# EAGLE design Spectroscilloscope Revised_2 (EAGLE 9.6.2)
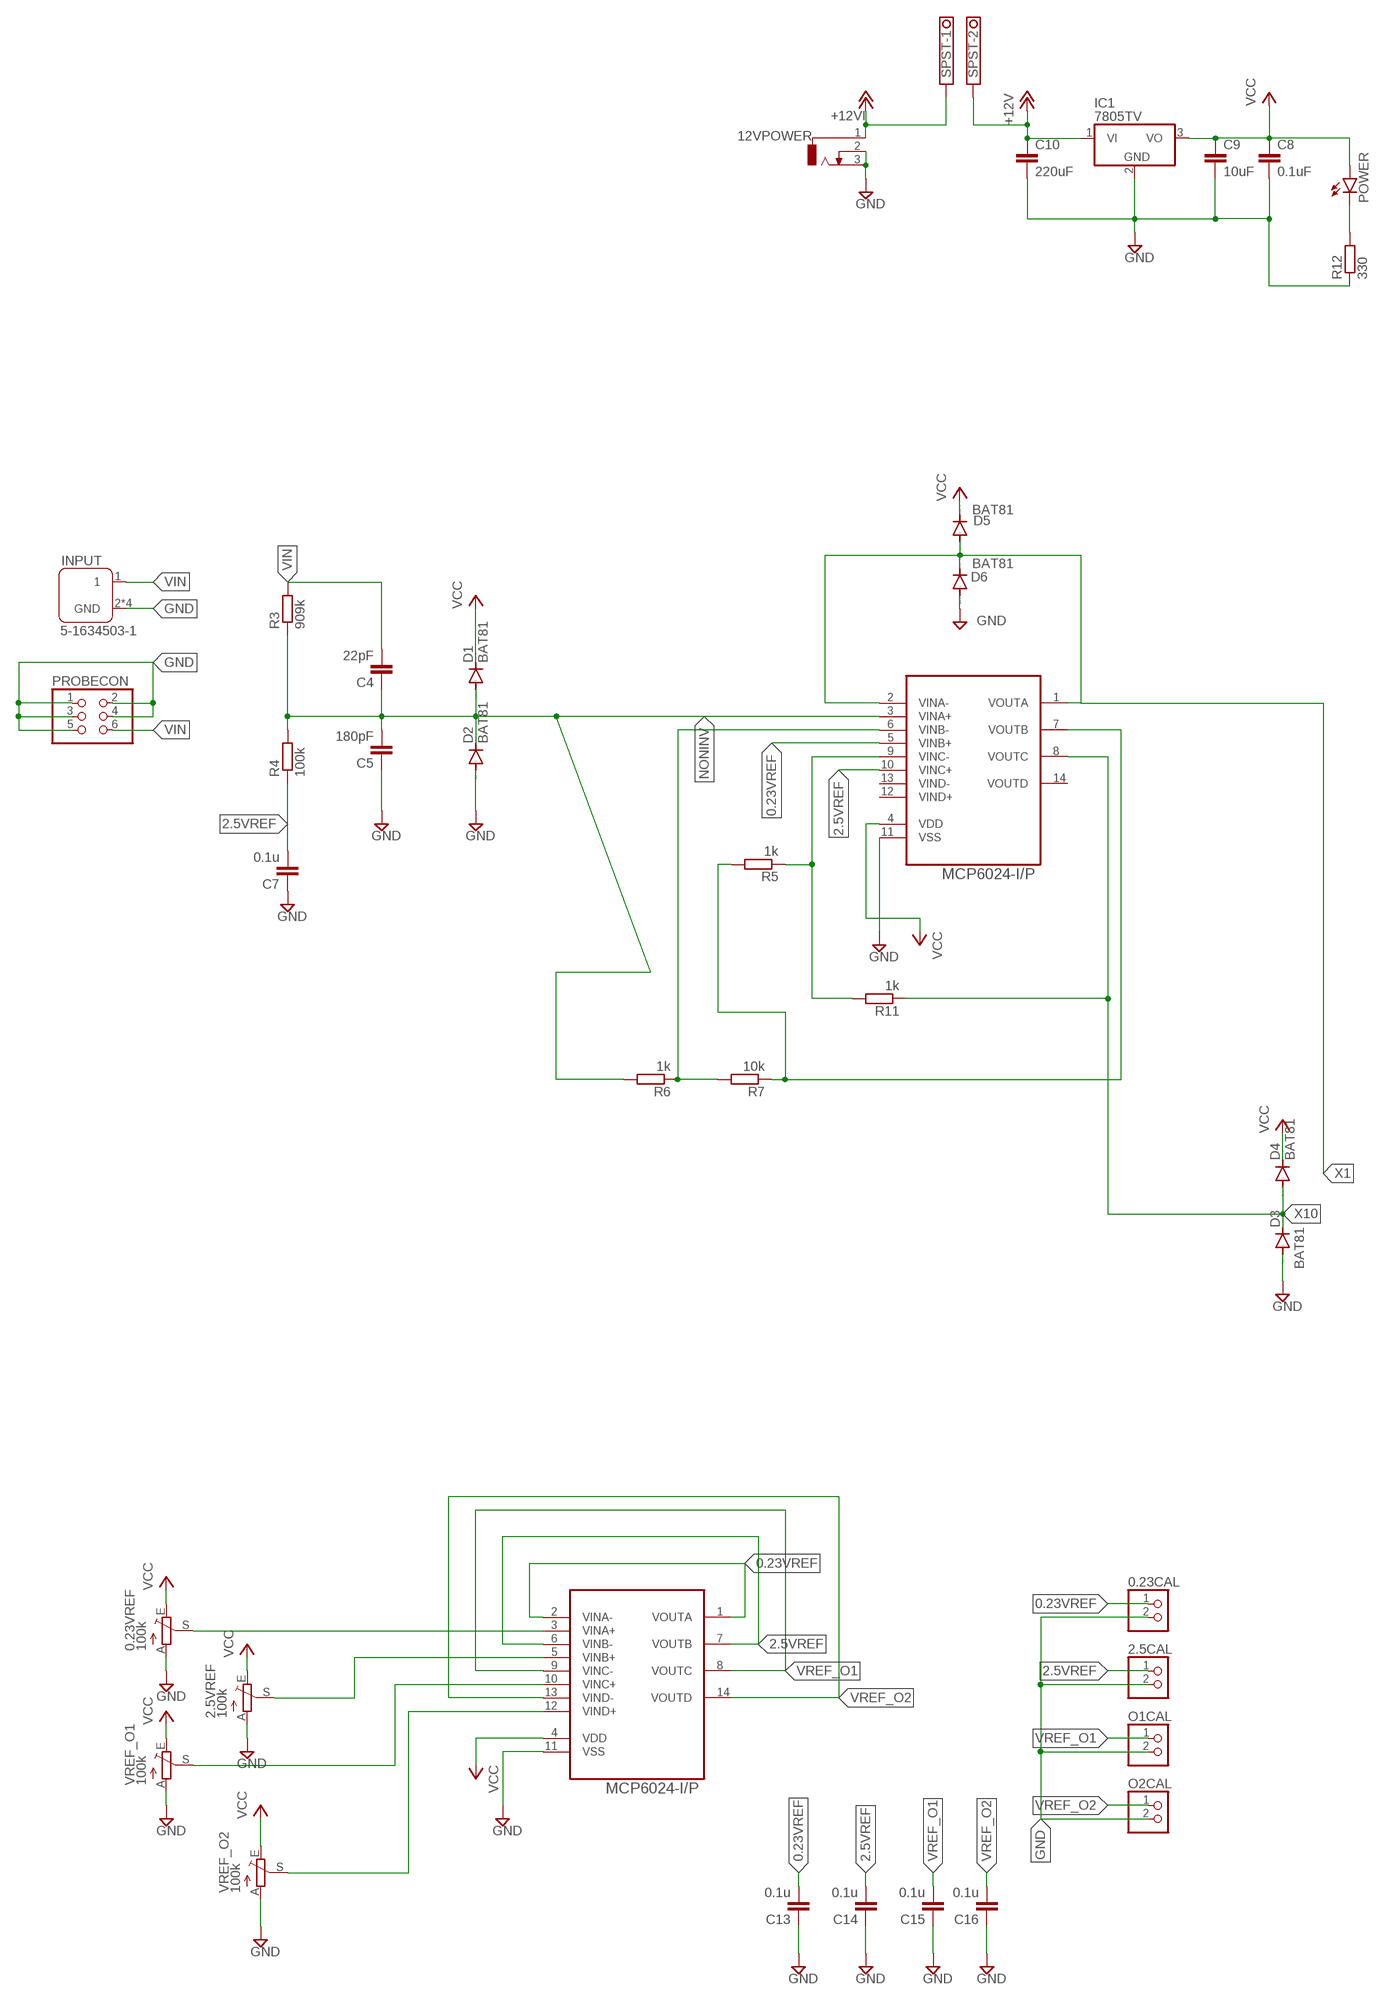
[diagram p0: schematic, sheet 1, part 1 of 2]
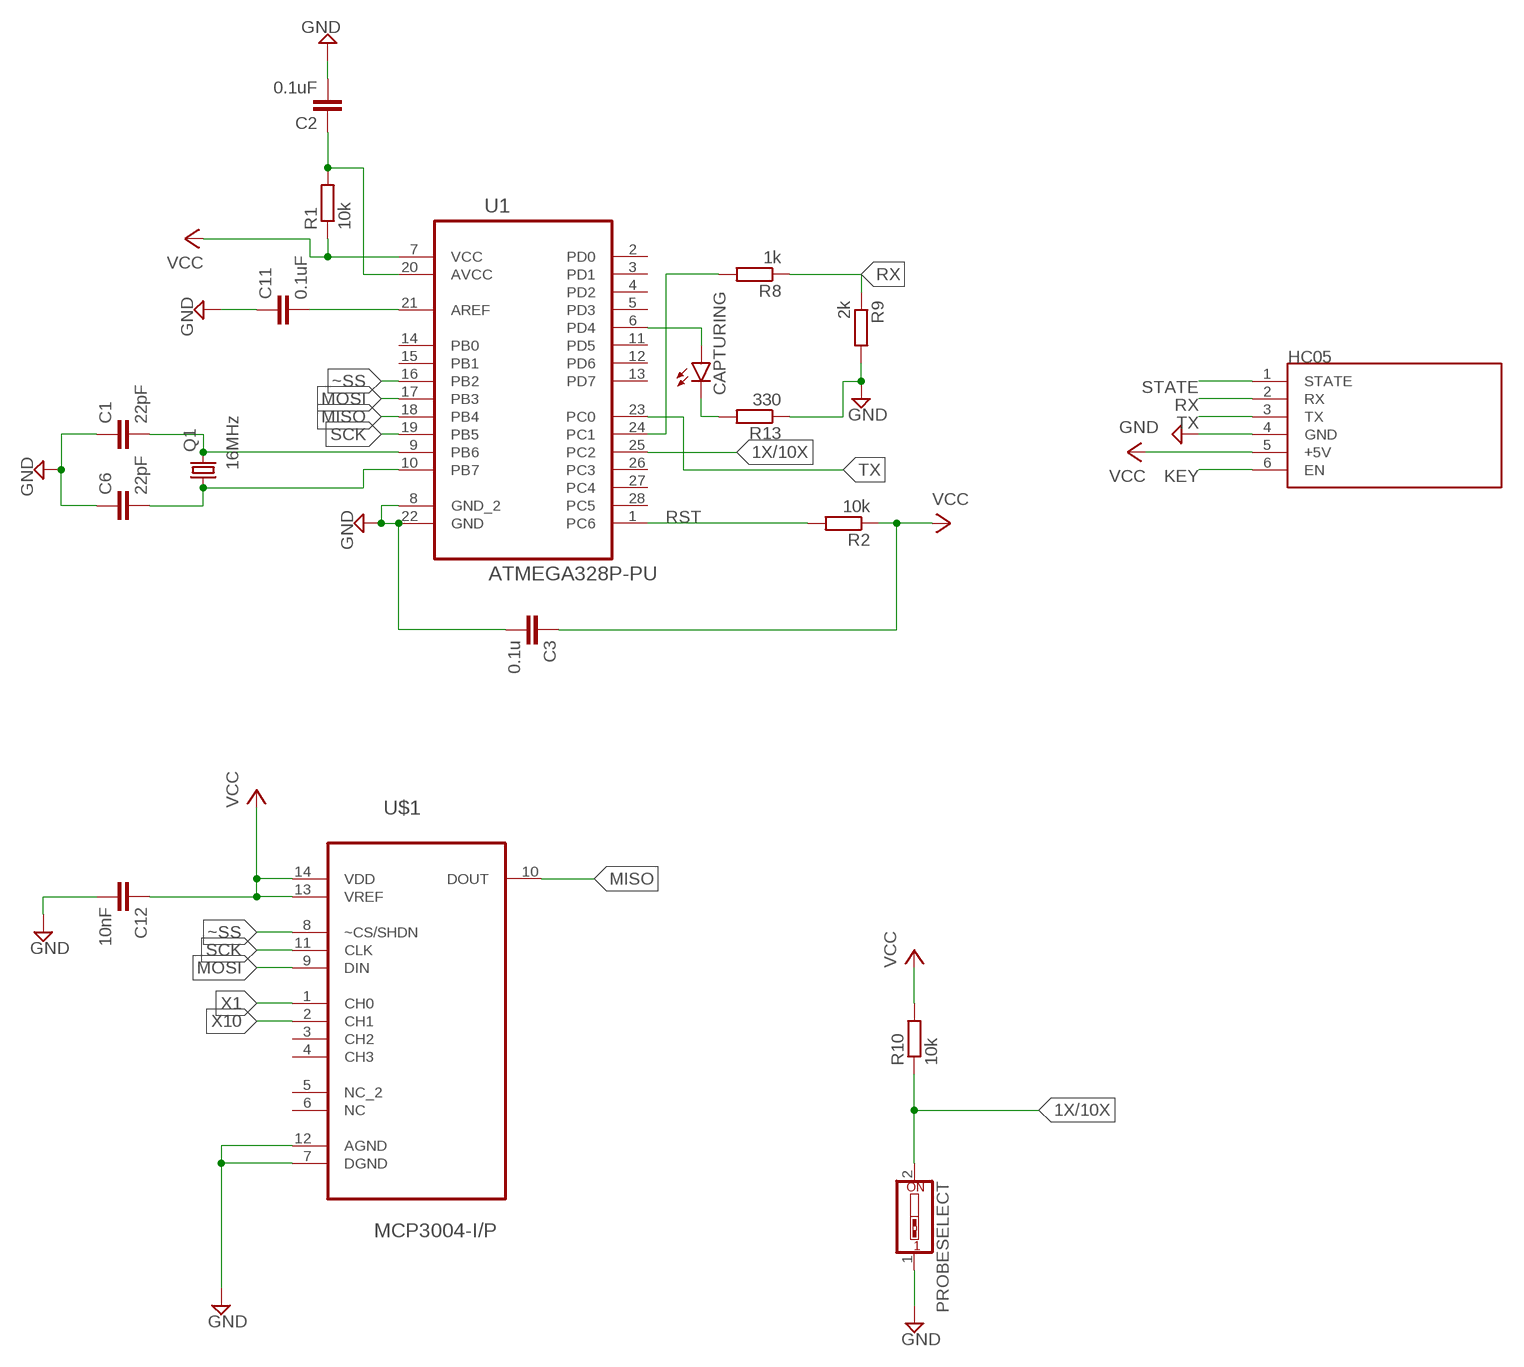
[diagram p1: schematic, sheet 1, part 2 of 2]

## Parts
0.23CAL  PINHD-1X2  [1X02]
0.23VREF  100k  TRIM_EU-B25P  [B25P]
2.5CAL  PINHD-1X2  [1X02]
2.5VREF  100k  TRIM_EU-B25P  [B25P]
12VPOWER  DCJ0303  [DCJ0303]
C1  22pF  C-EU050-024X044  [C050-024X044]
C2  0.1uF  C-EU050-024X044  [C050-024X044]
C3  0.1u  C-EU050-024X044  [C050-024X044]
C4  22pF  C-EU050-024X044  [C050-024X044]
C5  180pF  C-EU050-024X044  [C050-024X044]
C6  22pF  C-EU050-024X044  [C050-024X044]
C7  0.1u  C-EU050-024X044  [C050-024X044]
C8  0.1uF  C-EU050-024X044  [C050-024X044]
C9  10uF  C-EU050-024X044  [C050-024X044]
C10  220uF  C-EU050-024X044  [C050-024X044]
C11  0.1uF  C-EU050-024X044  [C050-024X044]
C12  10nF  C-EU050-024X044  [C050-024X044]
C13  0.1u  C-EU050-024X044  [C050-024X044]
C14  0.1u  C-EU050-024X044  [C050-024X044]
C15  0.1u  C-EU050-024X044  [C050-024X044]
C16  0.1u  C-EU050-024X044  [C050-024X044]
CAPTURING  LED5MM  [LED5MM]
D1  BAT81  [DO34-7]
D2  BAT81  [DO34-7]
D3  BAT81  [DO34-7]
D4  BAT81  [DO34-7]
D5  BAT81  [DO34-7]
D6  BAT81  [DO34-7]
HC05  WIRELESS-BLUETOOTH-HC-05  [WIRELESS-BLUETOOTH-HC-05]
IC1  7805TV  [TO220V]
INPUT  5-1634503-1  [TE_5-1634503-1]
O1CAL  PINHD-1X2  [1X02]
O2CAL  PINHD-1X2  [1X02]
POWER  LED5MM  [LED5MM]
PROBECON  PINHD-2X3  [2X03]
PROBESELECT  SW_DIP-1  [EDG-01]
Q1  16MHz  CRYSTALHC49U-V  [HC49U-V]
R1  10k  R-EU_0204/7  [0204/7]
R2  10k  R-EU_0204/7  [0204/7]
R3  909k  R-EU_0204/7  [0204/7]
R4  100k  R-EU_0204/7  [0204/7]
R5  1k  R-EU_0204/7  [0204/7]
R6  1k  R-EU_0204/7  [0204/7]
R7  10k  R-EU_0204/7  [0204/7]
R8  1k  R-EU_0204/7  [0204/7]
R9  2k  R-EU_0204/7  [0204/7]
R10  10k  R-EU_0204/7  [0204/7]
R11  1k  R-EU_0204/7  [0204/7]
R12  330  R-EU_0204/7  [0204/7]
R13  330  R-EU_0204/7  [0204/7]
SPST  TERMINAL-BLOCK-3.5MM-2-PIN-LONG-PAD  [TERMINAL-BLOCK-2-PIN-3.5MM-LONG-PAD]
U1  ATMEGA328P-PU  [DIP254P762X457-28]
U2  MCP6024-I/P  [DIP254P762X533-14]
U3  MCP6024-I/P  [DIP254P762X533-14]
U$1  MCP3004-I/P  [DIP254P762X432-14]
VREF_O1  100k  TRIM_EU-B25P  [B25P]
VREF_O2  100k  TRIM_EU-B25P  [B25P]

## Nets
0.23VREF: 0.23CAL.1 C13.2 U2.5(VINB+) U3.1(VOUTA) U3.2(VINA-)
1X/10X: PROBESELECT.2 R10.1 U1.25(PC2)
2.5VREF: 2.5CAL.1 C7.2 C14.2 R4.1 U2.10(VINC+) U3.6(VINB-) U3.7(VOUTB)
+12V [Power Lines]: C10.1 IC1.1(VI) SPST.2
+12VI [Power Lines]: 12VPOWER.1 SPST.1 ; supply symbol labelled +12V
GND [Power Lines]: 0.23CAL.2 0.23VREF.A 2.5CAL.2 2.5VREF.A 12VPOWER.2 12VPOWER.3 C1.1 C2.2 C3.2 C5.1 C6.1 C7.1 C8.2 C9.2 C10.2 C11.1 C12.2 C13.1 C14.1 C15.1 C16.1 D2.A D3.A D6.A HC05.4(GND) IC1.2(GND) INPUT.2(GND) INPUT.3(GND) INPUT.4(GND) INPUT.5(GND) O1CAL.2 O2CAL.2 PROBECON.1 PROBECON.2 PROBECON.3 PROBECON.4 PROBECON.5 PROBESELECT.1 R9.2 R12.1 R13.1 U1.8(GND_2) U1.22(GND) U2.11(VSS) U3.11(VSS) U$1.7(DGND) U$1.12(AGND) VREF_O1.A VREF_O2.A
KEY: HC05.6(EN)
MISO: U1.18(PB4) U$1.10(DOUT)
MOSI: U1.17(PB3) U$1.9(DIN)
N$1: C1.2 Q1.2 U1.9(PB6)
N$2: C6.2 Q1.1 U1.10(PB7)
N$3: 2.5VREF.S U3.5(VINB+)
N$4: R5.2 R7.1 U2.7(VOUTB)
N$5: R6.1 R7.2 U2.6(VINB-)
N$6: C11.2 U1.21(AREF)
N$7: U3.10(VINC+) VREF_O1.S
N$8: C2.1 R1.2 U1.20(AVCC)
N$9: 0.23VREF.S U3.3(VINA+)
N$10: U3.12(VIND+) VREF_O2.S
N$11: R3.1 R4.2
N$12: POWER.K(C) R12.2
N$13: CAPTURING.K(C) R13.2
N$14: CAPTURING.A U1.6(PD4)
N$16: R5.1 R11.2 U2.9(VINC-)
N$17: R8.2 U1.24(PC1)
NONINV: C4.1 C5.2 D1.A D2.C R6.2 U2.3(VINA+)
RST: R2.2 U1.1(PC6)
RX: HC05.2(RX) R8.1 R9.1
SCK: U1.19(PB5) U$1.11(CLK)
STATE: HC05.1(STATE)
TX: HC05.3(TX) U1.23(PC0)
VCC [Power Lines]: 0.23VREF.E 2.5VREF.E C3.1 C8.1 C9.1 C12.1 D1.C D4.C D5.C HC05.5(+5V) IC1.3(VO) POWER.A R1.1 R2.1 R10.2 U1.7(VCC) U2.4(VDD) U3.4(VDD) U$1.13(VREF) U$1.14(VDD) VREF_O1.E VREF_O2.E
VIN: C4.2 INPUT.1 PROBECON.6 R3.2
VREF_O1: C15.2 O1CAL.1 U3.8(VOUTC) U3.9(VINC-)
VREF_O2: C16.2 O2CAL.1 U3.13(VIND-) U3.14(VOUTD)
X1: D5.A D6.C U2.1(VOUTA) U2.2(VINA-) U$1.1(CH0)
X10: D3.C D4.A R11.1 U2.8(VOUTC) U$1.2(CH1)
~SS: U1.16(PB2) U$1.8(~CS/SHDN)
Unconnected: U1.2(PD0) U1.3(PD1) U1.4(PD2) U1.5(PD3) U1.11(PD5) U1.12(PD6) U1.13(PD7) U1.14(PB0) U1.15(PB1) U1.26(PC3) U1.27(PC4) U1.28(PC5) U2.12(VIND+) U2.13(VIND-) U2.14(VOUTD) U$1.3(CH2) U$1.4(CH3) U$1.5(NC_2) U$1.6(NC)

## Library data of the parts
0.23CAL 2.5CAL O1CAL O2CAL = pinhead:PINHD-1X2: PIN HEADER
0.23VREF 2.5VREF VREF_O1 VREF_O2 = pot:TRIM_EU-: POTENTIOMETER
12VPOWER = con-jack:DCJ0303: DC POWER JACK Source: DCJ0303.pdf
C1-C16 = rcl:C-EU: CAPACITOR, European symbol; SPICEPREFIX: C
CAPTURING POWER = led:LED: LED OSRAM: - CHIPLED LG R971, LG N971, LY N971, LG Q971, LY Q971, LO R971, LY R971 LH N974, LH R974 LS Q976, LO Q976, LY Q976 LO Q996 - Hyper CHIPLED LW Q18S LB Q993, LB Q99A, LB R99A - SideLED LS A670, LO A670, LY A670, LG A670, LP A670 LB A673, LV A673, LT A673, LW A673 LH A674 LY A675 LS A676, LA A676, LO A676, LY A676, LW A676 LS A679, LY A679, LG A679 - Hyper Micro SIDELED® LS Y876, LA Y876, LO Y876, LY Y876 LT Y87S - SmartLED LW L88C, LW L88S LB L89C, LB L89S, LG L890 LS L89K, LO L89K, LY L89K LS L896, LA L896, LO L896, LY L896 - TOPLED LS T670, LO T670, LY T670, LG T670, LP T670 LSG T670, LSP T670, LSY T670, LOP T670, LYG T670 LG T671, LOG T671, LSG T671 LB T673, LV T673, LT T673, LW T673 LH T674 LS T676, LA T676, LO T676, LY T676, LB T676, LH T676, LSB T676, LW T676 LB T67C, LV T67C, LT T67C, LS T67K, LO T67K, LY T67K, LW E67C LS E67B, LA E67B, LO E67B, LY E67B, LB E67C, LV E67C, LT E67C LW T67C LS T679, LY T679, LG T679 LS T770, LO T770, LY T770, LG T770, LP T770 LB T773, LV T773, LT T773, LW T773 LH T774 LS E675, LA E675, LY E675, LS T675 LS T776, LA T776, LO T776, LY T776, LB T776 LHGB T686 LT T68C, LB T68C - Hyper Mini TOPLED® LB M676 - Mini TOPLED Santana® LG M470 LS M47K, LO M47K, LY M47K Source: http://www.osram.convergy.de LUXEON: - LUMILED® LXK2-PW12-R00, LXK2-PW12-S00, LXK2-PW14-U00, LXK2-PW14-V00 LXK2-PM12-R00, LXK2-PM12-S00, LXK2-PM14-U00 LXK2-PE12-Q00, LXK2-PE12-R00, LXK2-PE12-S00, LXK2-PE14-T00, LXK2-PE14-U00 LXK2-PB12-K00, LXK2-PB12-L00, LXK2-PB12-M00, LXK2-PB14-N00, LXK2-PB14-P00, LXK2-PB14-Q00 LXK2-PR12-L00, LXK2-PR12-M00, LXK2-PR14-Q00, LXK2-PR14-R00 LXK2-PD12-Q00, LXK2-PD12-R00, LXK2-PD12-S00 LXK2-PH12-R00, LXK2-PH12-S00 LXK2-PL12-P00, LXK2-PL12-Q00, LXK2-PL12-R00 Source: www.luxeon.com KINGBRIGHT: KA-3528ASYC Source: www.kingbright.com
D1-D6 = diode:BAT81: DIODE barrier diode
HC05 = diy-modules:WIRELESS-BLUETOOTH-HC-05: Bluetooth Transceiver Module based on HC-05 board Tutorial is available here: https://arduino-info.wikispaces.com/BlueTooth-HC05-HC06-Modules-How-To Click here to find device on ebay.com <http://www.ebay.com/sch/hc-05+module+rs232>
IC1 = linear:78*: Positive VOLTAGE REGULATOR Source: http://cache.national.com/ds/LM/LM78L05.pdf http://www.fairchildsemi.com/ds/LM/LM7805.pdf
INPUT = 5-1634503-1:5-1634503-1: CONN BNC JACK STR 50 OHM PCB Check prices <https://pricing.snapeda.com/parts/5-1634503-1/TE%20Connectivity/view-part?ref=eda>; AVAILABILITY: Good; COMMENT: 5-1634503-1; DESCRIPTION: Rf / Coaxial Connector, Bnc Coaxial, Straight Jack, Solder, 50 Ohm, Brass; EU_ROHS_COMPLIANCE: Compliant; MF: TE Connectivity; MP: 5-1634503-1; NUMBER_OF_POSITIONS: 1; PACKAGE: None; PRICE: None; PURCHASE-URL: https://pricing.snapeda.com/search/part/5-1634503-1/?ref=eda
PROBECON = pinhead:PINHD-2X3: PIN HEADER
PROBESELECT = special:SW_DIP-1: DIP SWITCH
Q1 = crystal:CRYSTAL: CRYSTAL; OC_FARNELL: 1666969; OC_NEWARK: unknown
R1-R13 = rcl:R-EU_: RESISTOR, European symbol; SPICEPREFIX: R
SPST = Rembrandt Electronics - Terminal Block 3-5mm v1-0:TERMINAL-BLOCK-3.5MM-2-PIN: Terminal Block 3.5mm Pitch: 3,5 mm Number of pins: 2 Created by Rembrandt Electronics www.rembrandtelectronics.com
U1 = ATMEGA328P-PU:ATMEGA328P-PU: 8-bit Microcontroller with In-System Programmable Flash Buy Part <https://snapeda.com/parts/ATMEGA328P-PU/Microchip/view-part/?ref=eda>; AVAILABILITY: Good; DESCRIPTION: AVR AVR® ATmega Microcontroller IC 8-Bit 20MHz 32KB (16K x 16) FLASH 28-PDIP; DIGIKEY-PURCHASE-URL: https://snapeda.com/shop?store=DigiKey&id=2895131; MF: Microchip; MOUSER-PURCHASE-URL: https://snapeda.com/shop?store=Mouser&id=2895131; MP: ATMEGA328P-PU; PACKAGE: DIP-28 Generic; PRICE: None
U2 U3 = MCP6024-I_P:MCP6024-I/P: IC OPAMP 2.5V QUAD R-R Check prices <https://pricing.snapeda.com/parts/MCP6024-I/P/Microchip%20Technology/view-part?ref=eda>; AVAILABILITY: Warning; DESCRIPTION: IC OPAMP GP 4 CIRCUIT 14DIP; MF: Microchip Technology; MP: MCP6024-I/P; PACKAGE: None; PRICE: None; PURCHASE-URL: https://pricing.snapeda.com/search/part/MCP6024-I/P/?ref=eda
U$1 = MCP3004-I_P:MCP3004-I/P: A/D Converters; AVAILABILITY: Unavailable; DESCRIPTION: 10 Bit Analog to Digital Converter 2, 4 Input 1 SAR 14-PDIP; MF: Microchip; MP: MCP3004-I/P; PACKAGE: DIP-14 Microchip; PRICE: None

## Net classes
0 default: width 0.406 mm, clearance 0.102 mm
1 Power Lines: width 0.762 mm, clearance 0.13 mm

## Board
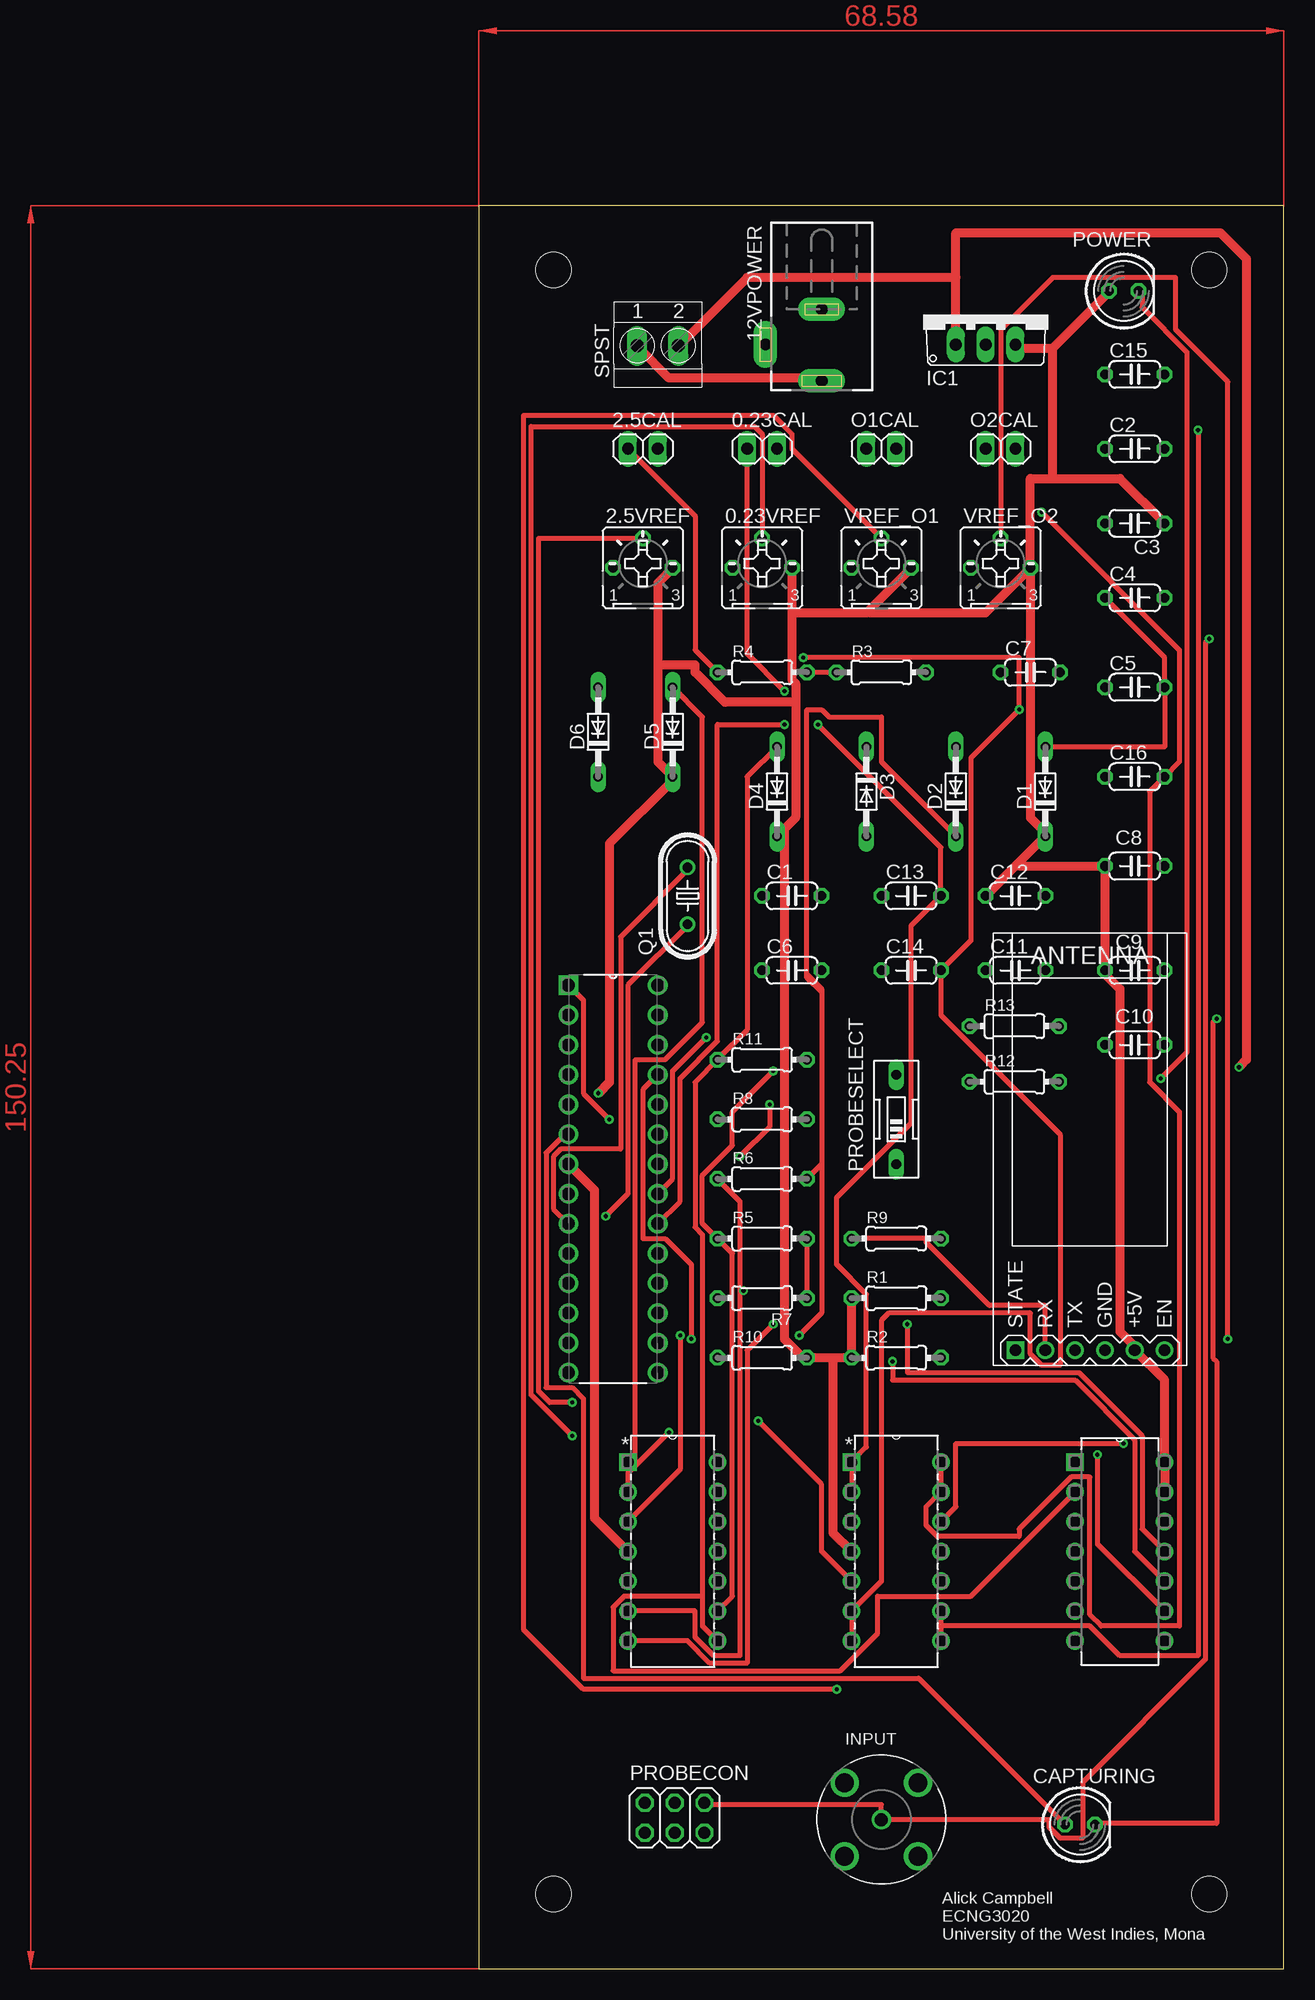
[diagram p2: board, top side]
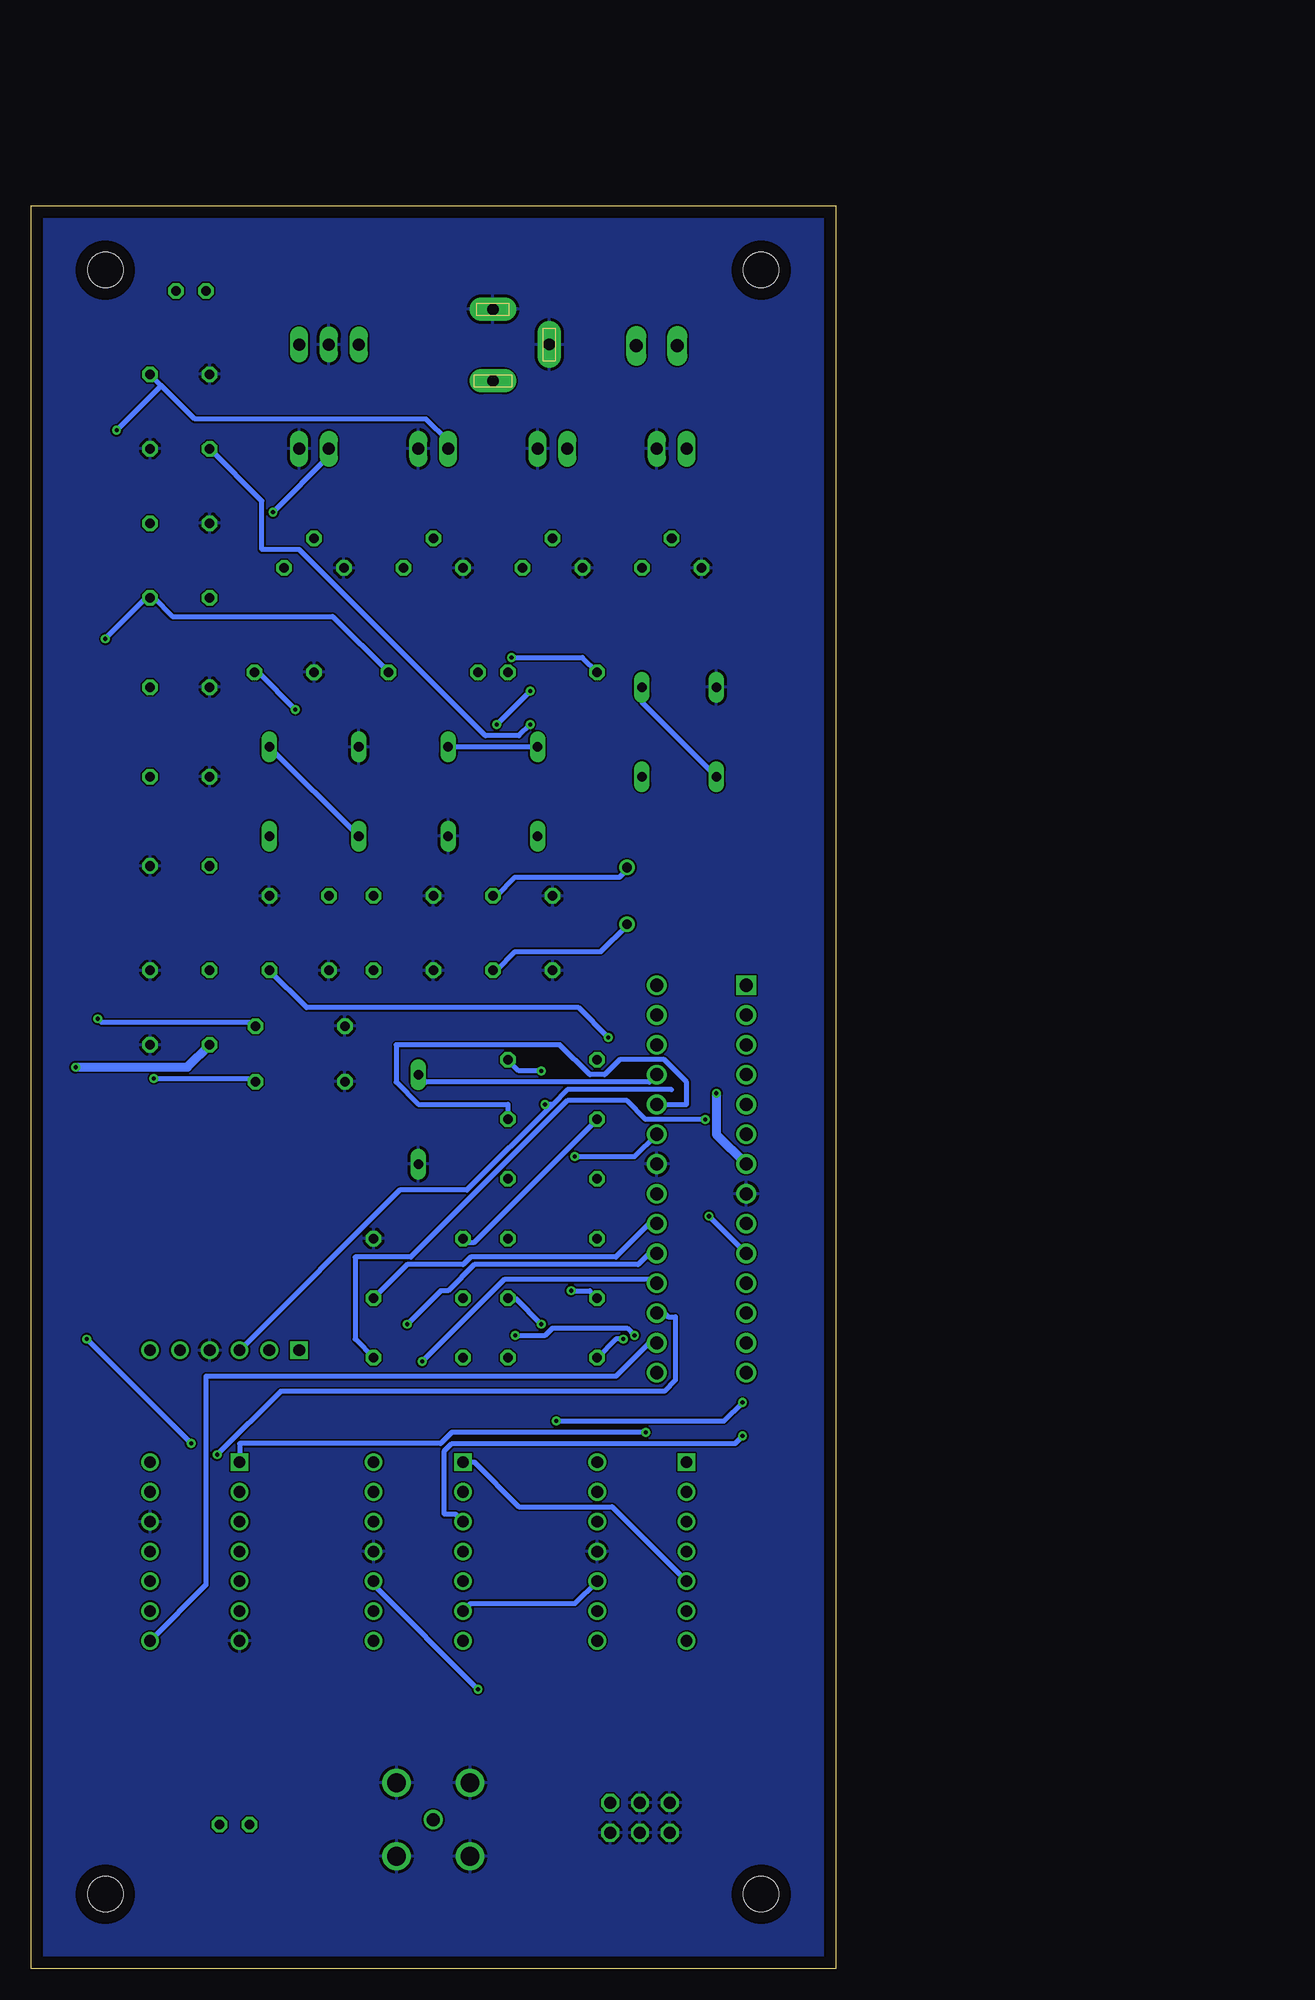
[diagram p3: board, bottom side, seen from below]

Size 68.56 x 150.25 mm. Coordinates in mm from the lower left corner, seen from the top.
Outline: 0,0 68.56,0 68.56,150.25 0,150.25 0,0
Copper layers (1*16): Top 0.035mm / dielectric 1.5mm / Bottom 0.035mm
Design rules "default": minimum track width 6mil, minimum drill 0.35mm, track to track 6mil, track to pad 6mil, pad to pad 6mil, via to via 6mil, smd to smd 6mil, copper to edge 40mil, drill to drill 6mil, minimum pad ring 10mil, minimum via ring 8mil, stop-mask expansion 4mil, vias tented up to drill 0mil, thermal gap 10mil
Holes 3 mm at 6.35,6.35 62.23,6.35 62.23,144.78 6.35,144.78

### Footprints (pad centres in the part's own frame; a part is rotated, then mirrored left to right if it is on the bottom)
1X02 = drill 1.016 long: 1 -1.27,0; 2 1.27,0
B25P = drill 0.813 octagon: A -2.54,0; E 2.54,0; S 0,2.54
DCJ0303 = drill 1 pad 2 long: 1 0,3.1; 2 4.8,0; 3 0,-3
C050-024X044 = drill 0.813 octagon: 1 -2.54,0; 2 2.54,0
LED5MM = drill 0.813 octagon: A -1.27,0; K 1.27,0
DO34-7 = drill 0.813 long: A 3.81,0; C -3.81,0
WIRELESS-BLUETOOTH-HC-05 = drill 1 square: 1 -6.35,-17.145 | drill 1: 2 -3.81,-17.145; 3 -1.27,-17.145; 4 1.27,-17.145; 5 3.81,-17.145; 6 6.35,-17.145
TO220V = drill 1.016 long: 1 -2.54,-2.54; 2 0,-2.54; 3 2.54,-2.54
TE_5-1634503-1 = drill 1.1: 1 0,0 | drill 1.6: 2 -3.13,3.13; 3 3.13,3.13; 4 3.13,-3.13; 5 -3.13,-3.13
2X03 = drill 1.016 octagon: 1 -2.54,-1.27; 2 -2.54,1.27; 3 0,-1.27; 4 0,1.27; 5 2.54,-1.27; 6 2.54,1.27
EDG-01 = drill 0.813 long: 1 0,-3.81; 2 0,3.81
HC49U-V = drill 0.813: 1 -2.413,0; 2 2.413,0
0204/7 = drill 0.813 octagon: 1 -3.81,0; 2 3.81,0
TERMINAL-BLOCK-2-PIN-3.5MM-LONG-PAD = drill 1.1 pad 1.7 long: 1 -1.75,-0.1; 2 1.75,-0.1
DIP254P762X457-28 = drill 1.118 square: 1 -7.62,33.02 | drill 1.118: 2 -7.62,30.48; 3 -7.62,27.94; 4 -7.62,25.4; 5 -7.62,22.86; 6 -7.62,20.32; 7 -7.62,17.78; 8 -7.62,15.24; 9 -7.62,12.7; 10 -7.62,10.16; 11 -7.62,7.62; 12 -7.62,5.08; 13 -7.62,2.54; 14 -7.62,0; 15 0,0; 16 0,2.54; 17 0,5.08; 18 0,7.62; 19 0,10.16; 20 0,12.7; 21 0,15.24; 22 0,17.78; 23 0,20.32; 24 0,22.86; 25 0,25.4; 26 0,27.94; 27 0,30.48; 28 0,33.02
DIP254P762X533-14 = drill 0.991 square: 1 -7.62,15.24 | drill 0.991: 2 -7.62,12.7; 3 -7.62,10.16; 4 -7.62,7.62; 5 -7.62,5.08; 6 -7.62,2.54; 7 -7.62,0; 8 0,0; 9 0,2.54; 10 0,5.08; 11 0,7.62; 12 0,10.16; 13 0,12.7; 14 0,15.24
DIP254P762X432-14 = drill 0.991 square: 1 -7.62,15.24 | drill 0.991: 2 -7.62,12.7; 3 -7.62,10.16; 4 -7.62,7.62; 5 -7.62,5.08; 6 -7.62,2.54; 7 -7.62,0; 8 0,0; 9 0,2.54; 10 0,5.08; 11 0,7.62; 12 0,10.16; 13 0,12.7; 14 0,15.24

### Placement (x,y rotation side)
0.23CAL  24.13,129.54 0 top
0.23VREF  24.13,119.38 0 top
2.5CAL  13.97,129.54 0 top
2.5VREF  13.97,119.38 0 top
12VPOWER  29.21,138.43 180 top
C1  26.67,91.44 0 top
C2  55.88,129.54 0 top
C3  55.88,123.19 180 top
C4  55.88,116.84 0 top
C5  55.88,109.22 0 top
C6  26.67,85.09 0 top
C7  46.99,110.49 0 top
C8  55.88,93.98 0 top
C9  55.88,85.09 0 top
C10  55.88,78.74 0 top
C11  45.72,85.09 0 top
C12  45.72,91.44 0 top
C13  36.83,91.44 0 top
C14  36.83,85.09 0 top
C15  55.88,135.89 0 top
C16  55.88,101.6 0 top
CAPTURING  51.22,12.27 0 top
D1  48.26,100.33 90 top
D2  40.64,100.33 90 top
D3  33.02,100.33 270 top
D4  25.4,100.33 90 top
D5  16.51,105.41 90 top
D6  10.16,105.41 90 top
HC05  52.07,69.85 0 top
IC1  43.18,140.97 0 top
INPUT  34.29,12.7 0 top
O1CAL  34.29,129.54 0 top
O2CAL  44.45,129.54 0 top
POWER  54.94,142.98 0 top
PROBECON  16.68,12.86 0 top
PROBESELECT  35.56,72.39 0 top
Q1  17.78,91.44 90 top
R1  35.56,57.15 0 top
R2  35.56,52.07 0 top
R3  34.29,110.49 0 top
R4  24.13,110.49 0 top
R5  24.13,62.23 0 top
R6  24.13,67.31 0 top
R7  24.13,57.15 180 top
R8  24.13,72.39 0 top
R9  35.56,62.23 0 top
R10  24.13,52.07 0 top
R11  24.13,77.47 0 top
R12  45.63,75.6 0 top
R13  45.63,80.34 0 top
SPST  15.24,138.43 0 top
U1  15.24,50.8 0 top
U2  20.32,27.94 0 top
U3  39.37,27.94 0 top
U$1  58.42,27.94 0 top
VREF_O1  34.29,119.38 0 top
VREF_O2  44.45,119.38 0 top

### Tracks (layer width: path | path; a pad name or v marks a point on that pad's centre or on a via)
0.23VREF  (via drill 0.35)
  Top 0.406: U3.2 U3.1 33.02,44.45 33.02,57.47 30.48,60.01 30.48,65.72 36.83,72.07 36.83,88.9 C13.2 39.37,95.57 v28.89,106.04 | 0.23CAL.1 22.86,112.08 v26.04,108.9
  Bottom 0.406: U2.5 19.05,39.37 26.99,39.37 30.8,43.18 U3.1 | v28.89,106.04 v26.04,108.9
1X/10X  (via drill 0.35)
  Top 0.406: v18.1,53.66 18.1,60.01 15.88,62.23 13.97,62.23 13.97,74.93 U1.25
  Bottom 0.406: R10.1 18.73,53.66 v18.1,53.66 | PROBESELECT.2 34.93,75.56 15.88,75.56 U1.25
2.5VREF  (via drill 0.35)
  Top 0.406: R4.1 18.41,112.4 18.41,123.82 2.5CAL.1 | U3.7 U3.6 34.29,33.02 34.29,55.25 34.93,55.88 46.99,55.88 46.99,52.39 47.94,51.44 49.53,51.44 49.53,71.12 39.37,81.28 C14.2 41.91,87.63 41.91,103.19 v46.04,107.31 46.04,111.76 v27.62,111.76
  Bottom 0.406: U2.10 22.23,31.12 31.12,31.12 U3.6 | v46.04,107.31 49.21,110.49 C7.2 | R4.1 21.59,111.76 v27.62,111.76
+12V  (via drill 0.35)
  Top 0.762: v64.77,76.83 65.4,77.47 65.4,145.73 63.18,147.96 40.64,147.96 40.64,144.15 | IC1.1 40.64,144.15 | 40.64,144.15 22.86,144.15 17.14,138.43 SPST.2
  Bottom 0.762: C10.1 55.24,76.83 v64.77,76.83
+12VI
  Top 0.762: SPST.1 13.65,138.11 16.19,135.57 29.21,135.57 12VPOWER.1
GND
  pour Bottom: 68.58,0 0,0 0,150.24 68.58,150.24
MISO  (via drill 0.35)
  Top 0.406: U$1.10 55.88,35.56 55.88,45.08 50.8,50.17 35.24,50.17 v35.24,51.75
  Bottom 0.406: v35.24,51.75 28.26,58.74 15.56,58.74 U1.18
MOSI  (via drill 0.35)
  Top 0.406: U$1.9 52.7,36.19 v52.7,43.81
  Bottom 0.406: v52.7,43.81 47.31,49.21 14.61,49.21 13.65,50.17 13.65,55.56 14.29,55.56 14.61,55.88 U1.17
N$1
  Top 0.406: U1.9 6.35,64.77 6.35,69.22 6.99,69.85 12.07,69.85 12.07,87.95 17.78,93.66 Q1.2
  Bottom 0.406: C1.2 28.89,91.44 27.3,93.03 18.41,93.03 17.78,93.66 Q1.2
N$2  (via drill 0.35)
  Top 0.406: v10.8,64.14 12.7,66.04 12.7,83.82 17.78,88.9 Q1.1
  Bottom 0.406: C6.2 28.89,85.09 27.3,86.68 20,86.68 17.78,88.9 Q1.1 | v10.8,64.14 U1.10
N$3  (via drill 0.35)
  Top 0.406: 2.5VREF.S 5.08,121.92 5.08,49.21 6.03,48.26 v7.94,48.26 | v23.81,46.67 29.21,41.28 29.21,35.56 U3.5
  Bottom 0.406: v7.94,48.26 9.52,46.67 v23.81,46.67
N$4  (via drill 0.35)
  Top 0.406: R5.2 R7.1 | U2.7 17.78,27.94 19.69,26.03 22.86,26.03 22.86,52.7 v25.08,54.93
  Bottom 0.406: v25.08,54.93 27.3,57.15 R7.1
N$5  (via drill 0.35)
  Top 0.406: 22.23,58.1 v22.54,57.78 | 22.23,58.1 22.23,65.41 R6.1 | U2.6 18.41,30.48 18.41,28.26 20,26.67 22.23,26.67 22.23,58.1
  Bottom 0.406: R7.2 20.96,57.78 v22.54,57.78
N$6  (via drill 0.35)
  Top 0.406: v19.37,79.38 16.51,76.52 16.51,67.31 U1.21
  Bottom 0.406: C11.2 45.09,81.92 21.91,81.92 v19.37,79.38
N$7  (via drill 0.35)
  Top 0.406: VREF_O1.S 26.67,129.54 26.67,130.81 25.08,132.4 3.81,132.4 3.81,28.89 8.89,23.81 v30.48,23.81
  Bottom 0.406: v30.48,23.81 39.37,32.7 U3.10
N$8  (via drill 0.35)
  Top 0.406: v26.04,106.04 20.32,106.04 20.32,79.06 17.14,75.88 17.14,65.41 U1.20
  Bottom 0.406: R1.2 36.51,60.01 31.75,60.01 31.12,60.64 18.73,60.64 15.88,63.5 U1.20 | C2.1 48.9,125.09 48.9,120.97 45.72,120.97 29.84,105.09 26.99,105.09 v26.04,106.04
N$9  (via drill 0.35)
  Top 0.406: 0.23VREF.S 24.13,130.81 23.5,131.44 4.45,131.44 4.45,48.89 v7.94,45.4
  Bottom 0.406: v7.94,45.4 8.57,44.77 32.7,44.77 33.34,44.13 33.34,38.73 32.38,38.73 U3.3
N$10  (via drill 0.35)
  Top 0.406: VREF_O2.S 44.45,139.7 48.9,144.15 59.37,144.15 59.37,139.7 63.82,135.25 v63.82,53.66 | v54.93,44.77 40.64,44.77 40.64,39.37 U3.12
  Bottom 0.406: v54.93,44.77 v63.82,53.66
N$11
  Top 0.406: R4.2 R3.1
N$12  (via drill 0.35)
  Top 0.406: v58.1,75.88 60.33,78.11 60.33,137.79 56.52,141.6 56.52,142.88 POWER.K
  Bottom 0.406: v58.1,75.88 49.53,75.88 R12.2
N$13  (via drill 0.35)
  Top 0.406: v62.87,80.96 62.55,80.64 62.55,52.07 62.87,51.75 62.87,12.38 52.7,12.38 CAPTURING.K
  Bottom 0.406: v62.87,80.96 62.55,80.64 49.53,80.64 R13.2
N$14
  Top 0.406: U1.6 7.3,71.12 5.72,69.53 5.72,49.53 7.94,49.53 8.89,48.58 8.89,24.77 37.47,24.77 49.85,12.38 CAPTURING.A
N$16  (via drill 0.35)
  Top 0.406: U2.9 21.59,31.75 21.59,60.96 R5.1 19.05,63.5 19.05,67.63 21.59,70.17 21.59,73.03 v25.08,76.52
  Bottom 0.406: R11.2 26.99,76.52 v25.08,76.52
N$17
  Bottom 0.406: R8.2 27.94,73.66 35.56,73.66 37.47,75.56 37.47,78.74 23.5,78.74 20.96,76.2 19.69,76.2 18.41,77.47 14.61,77.47 12.7,75.56 12.7,73.66 U1.24
NONINV  (via drill 0.35)
  Top 0.406: D1.A 58.42,104.14 C5.2 58.42,111.76 C4.1 | 29.21,68.58 R6.2 | 29.21,83.19 29.21,83.5 27.94,84.77 | 29.21,83.19 29.21,68.58 | D2.C 34.29,102.87 34.29,106.68 29.84,106.68 29.21,107.31 27.94,107.31 27.94,84.45 29.21,83.19 | U2.3 17.14,42.55 v17.14,53.97 | v27.3,53.97 29.21,55.88 29.21,68.58
  Bottom 0.406: v17.14,53.97 17.78,54.61 24.13,54.61 24.77,53.97 v27.3,53.97 | D2.C D1.A
RST  (via drill 0.35)
  Top 0.406: v11.11,72.39 8.89,74.61 8.89,82.55 U1.1
  Bottom 0.406: R2.2 40.96,53.66 40.96,60.64 36.2,60.64 22.86,73.98 17.78,73.98 16.19,72.39 v11.11,72.39
RX
  Top 0.406: R9.1 38.1,62.23 38.1,61.91 43.5,56.52 48.26,56.52 HC05.2
  Bottom 0.406: R8.1 30.8,61.91 31.43,61.91 R9.1
SCK  (via drill 0.35)
  Top 0.406: U$1.11 56.52,37.47 56.52,45.4 51.12,50.8 36.51,50.8 v36.51,54.93
  Bottom 0.406: v36.51,54.93 33.66,57.78 33.02,57.78 30.8,60.01 16.83,60.01 15.88,60.96 U1.19
TX  (via drill 0.35)
  Top 0.406: v22.23,69.22 24.77,71.75 v24.77,73.66
  Bottom 0.406: HC05.3 37.15,66.36 31.43,66.36 24.13,73.66 | 24.13,73.66 22.86,74.93 13.97,74.93 | U1.23 17.14,69.22 v22.23,69.22 | 24.13,73.66 v24.77,73.66
VCC  (via drill 0.35)
  Top 0.762: U$1.13 U$1.14 58.42,50.17 HC05.5 55.88,53.02 54.61,54.29 54.61,83.5 53.34,84.77 C9.1 C8.1 46.04,93.98 45.88,94.14 | 45.88,94.14 D1.C 48.26,96.84 46.99,98.11 VREF_O2.E | 45.88,94.14 C12.1 | U2.4 9.84,38.42 9.84,66.36 U1.7 | 30.16,52.07 R2.1 R1.1 | 30.16,52.07 R10.2 27.62,52.07 26.04,53.66 26.04,96.84 D4.C 26.99,98.11 26.99,107.95 | U3.4 30.16,37.15 30.16,52.07 | 15.24,111.12 15.24,118.11 2.5VREF.E | 15.24,111.12 15.24,102.87 D5.C 16.51,101.28 11.11,95.89 11.11,75.56 v10.16,74.61 | 48.9,138.11 53.66,142.88 POWER.A | 48.9,138.11 45.72,138.11 IC1.3 | 26.99,107.95 26.99,109.54 26.67,109.85 26.67,115.57 | 0.23VREF.E 26.67,115.57 | 33.18,115.73 33.02,115.57 26.67,115.57 | 33.18,115.73 VREF_O1.E | VREF_O2.E 43.18,115.57 33.34,115.57 33.18,115.73 | C3.1 54.61,127 48.9,127 | 48.9,127 46.99,127 VREF_O2.E | 48.9,127 48.9,138.11 | 15.24,111.12 18.41,111.12 18.41,110.49 20.96,107.95 26.99,107.95
  Bottom 0.762: U1.7 10.16,71.12 v10.16,74.61
VIN  (via drill 0.35)
  Top 0.406: PROBECON.6 19.37,13.97 34.29,13.97 INPUT.1 48.58,12.7 48.58,12.06 49.53,11.11 51.44,11.11 51.44,15.88 61.91,26.35 61.91,113.03 v62.23,113.35
  Bottom 0.406: R3.2 42.86,115.25 56.52,115.25 58.1,116.84 C4.2 58.74,116.84 v62.23,113.35
VREF_O1  (via drill 0.35)
  Top 0.406: U3.9 39.37,29.21 | 39.37,29.21 U3.8 | 39.37,29.21 52.07,29.21 54.61,26.67 61.28,26.67 v61.28,131.13
  Bottom 0.406: 57.47,134.94 54.61,132.08 34.93,132.08 33.02,130.18 O1CAL.1 | 57.47,134.94 C15.2 | 57.47,134.94 v61.28,131.13
VREF_O2  (via drill 0.35)
  Top 0.406: U3.14 U3.13 38.1,39.37 38.1,37.78 39.05,36.83 46.04,36.83 46.04,37.47 50.48,41.91 52.07,41.91 52.07,30.16 53.02,29.21 59.69,29.21 59.69,73.03 57.15,75.56 57.15,100.33 C16.2 59.69,102.87 59.69,112.4 v47.94,124.14
  Bottom 0.406: v47.94,124.14 43.18,128.91 O2CAL.1
X1  (via drill 0.35)
  Top 0.406: 12.7,42.23 U2.1 13.34,42.86 | 12.7,42.23 U2.2 | 12.7,42.23 13.34,42.86 | 13.34,42.86 v16.19,45.72 | D5.A 19.05,106.68 19.05,80.64 15.88,77.47 13.34,77.47 13.34,42.86
  Bottom 0.406: D6.C 16.51,107.95 D5.A | U$1.1 50.8,44.77 33.66,44.77 32.7,45.72 v16.19,45.72
X10
  Top 0.406: D4.A 22.86,101.6 22.86,80.01 R11.1 18.41,75.56 18.41,63.18 19.05,62.55 19.05,31.75 | U2.8 19.05,29.21 19.05,31.75 | U$1.2 41.91,31.75 33.97,31.75 33.97,28.58 30.8,25.4 11.43,25.4 11.43,30.8 12.38,31.75 19.05,31.75
  Bottom 0.406: D4.A D3.C
~SS
  Bottom 0.406: U$1.8 53.66,32.7 53.66,50.48 18.73,50.48 15.88,53.34 U1.16
(copper drawn outside any net)
  shapes: Top area x2

### Text on the board
tPlace: Alick Campbell / ECNG3020 / University of the West Indies, Mona